# EasyEDA schematic PlanBElektronischSchema.json
TITLE: Sheet_1; REV: 1.0; Date: 2022-10-18; Sheet: 1/1; Drawn By: milanvannieuwenhuyze; Company: Your Company
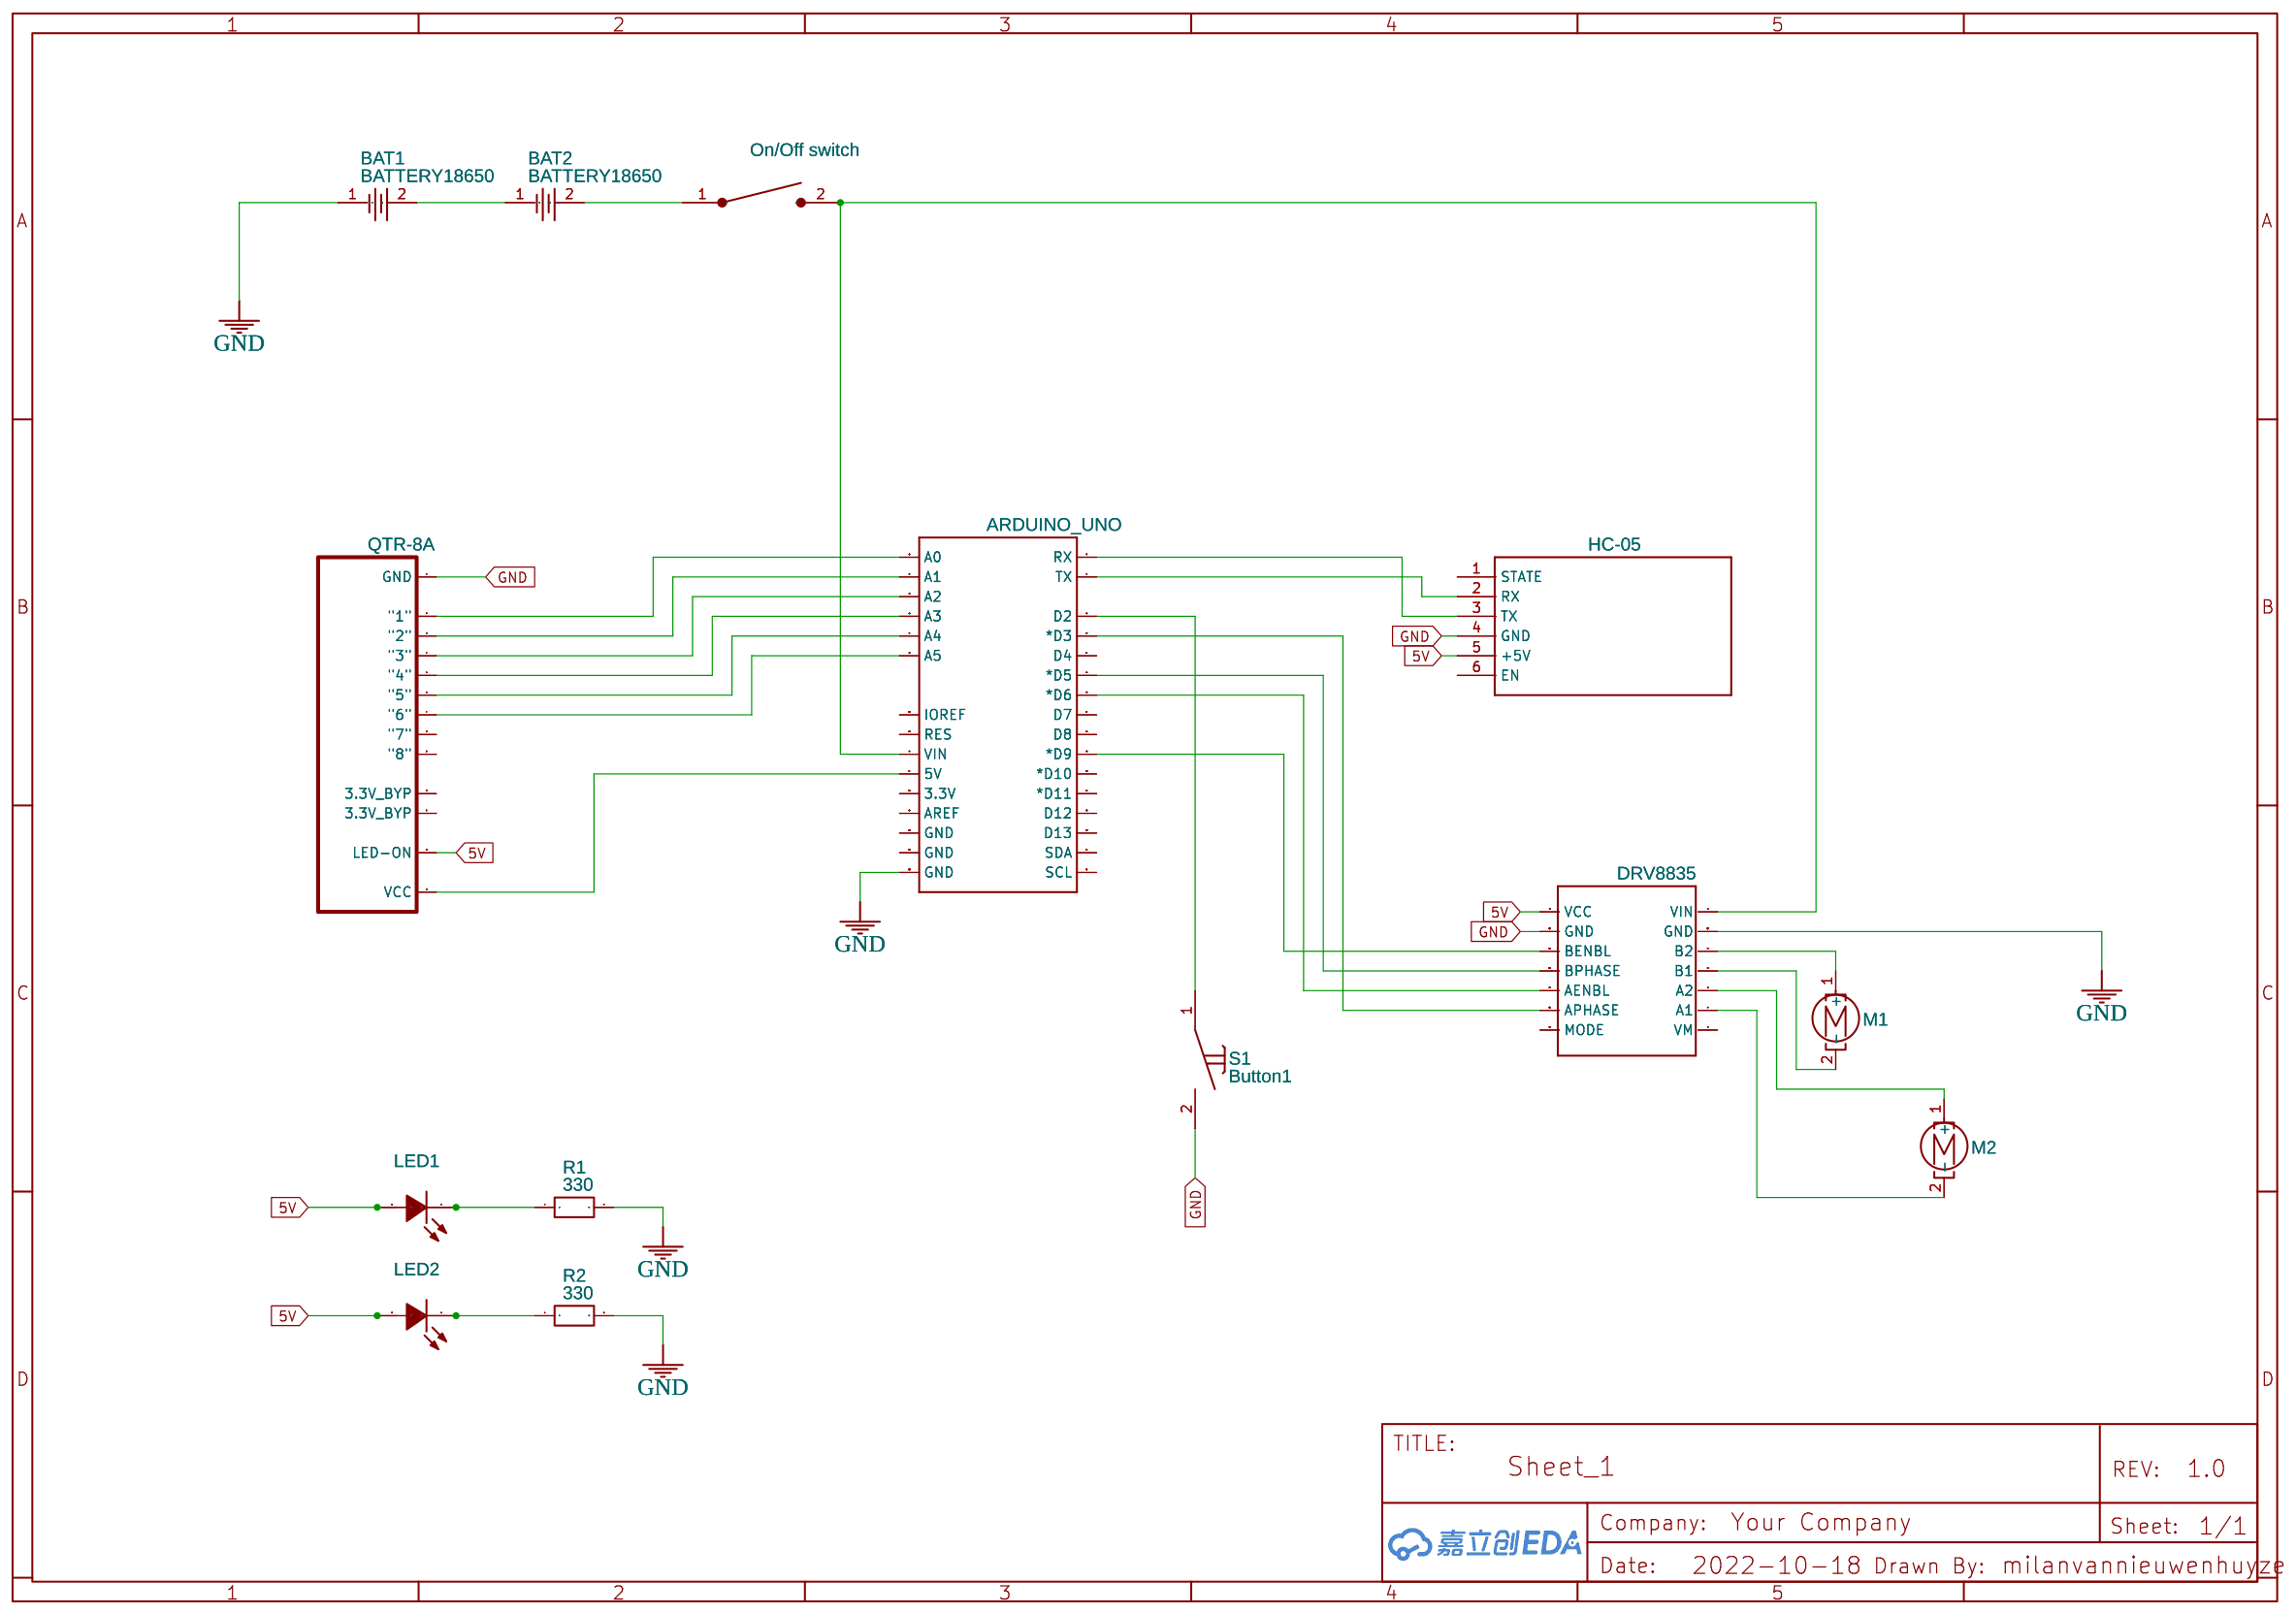
[diagram p0: schematic sheet]

## Parts
1  HC-05  [WIRELESS-BLUETOOTH-HC-05]
A2  DRV8835  [POLOLU_DRV8835]
BAT1  BATTERY18650  [BATTERY-SMD_18650-1S-L77.1-W20.7-1]
BAT2  BATTERY18650  [BATTERY-SMD_18650-1S-L77.1-W20.7-1]
LED1  BL-HUE35A-AV-TRE  [LED0805-RD_BRTLED_BL-HUE35A-AV-TRE]
LED2  BL-HUE35A-AV-TRE  [LED0805-RD_BRTLED_BL-HUE35A-AV-TRE]
M1  Motor_DC_ALT
M2  Motor_DC_ALT
R1  330  [R0603]
R2  330  [R0603]
S1  Button1  [3X5 PUSHBUTTON]
U1  ARDUINO_UNO  [UNO_R3_SHIELD_NOLABELS]
U2  QTR-8A  [QTR-8A/8RC]
U3  On/Off switch  [ON/OFF SWITCH]

## Library data of the parts
1 = WIRELESS-BLUETOOTH-HC-05: Contributor: Apdo Elnbrawy
A2 = POLOLU_DRV8835: Contributor: dcunderlik123
BAT1 BAT2 = BH-18650-B1BA002: Supplier: LCSC; Supplier Part: C2988620; Manufacturer: MYOUNG(美阳); link: https://atta.szlcsc.com/upload/public/pdf/source/20220402/870DB99AB50CA0DF8D51CF7C86A51FAB.pdf; Contributor: lcsc; JLCPCB Part Class: Extended Part
LED1 LED2 = BL-HUE35A-AV-TRE: Supplier: LCSC; Manufacturer: BrtLed; Contributor: LCSC; Supplier Part: C138549; JLCPCB Part Class: Extended Part
M1 M2 = Motor_DC_ALT: Contributor: KiCAD; license: https://www.gnu.org/licenses/lgpl-2.1.html
R1 R2 = R_0603_EU: Contributor: LCEDA_Lib
S1 = Button1: sourceId: K60iAuM3l
U1 = ARDUINO_R3_SHIELD: Contributor: SparkFun
U2 = QTR-8A: Manufacturer: Pololu; Supplier: Pololu; Supplier Part: 960; link: https://www.pololu.com/docs/pdf/0J12/QTR-8x.pdf; Contributor: Junikos
U3 = On/Off switch: Contributor: MarekFilip

## Nets
5V: 1.5(+5V) A2.VCC LED1.2(A) LED2.2(A) U1.5V U2.12(LED-ON)
GND: 1.4(GND) A2.GND@1(GND) A2.GND@2(GND) BAT1.1 R1.2 R2.2 S1.2 U1.GND@0(GND) U2.1(GND)
Net-(1-2): 1.2(RX) U1.TX
Net-(1-3): 1.3(TX) U1.RX
Net-(A2-A1): A2.A1 M2.2(-)
Net-(A2-A2): A2.A2 M2.1(+)
Net-(A2-AENBL): A2.AENBL U1.D6(*D6)
Net-(A2-APHASE): A2.APHASE U1.D3(*D3)
Net-(A2-B1): A2.B1 M1.2(-)
Net-(A2-B2): A2.B2 M1.1(+)
Net-(A2-BENBL): A2.BENBL U1.D9(*D9)
Net-(A2-BPHASE): A2.BPHASE U1.D5(*D5)
Net-(A2-VIN): A2.VIN U1.VIN U3.2
Net-(BAT1-2): BAT1.2 BAT2.1
Net-(BAT2-2): BAT2.2 U3.1
Net-(LED1-1): LED1.1(K) R1.1
Net-(LED2-1): LED2.1(K) R2.1
Net-(S1-1): S1.1 U1.D2
Net-(U1-A0): U1.A0 U2.2("1")
Net-(U1-A1): U1.A1 U2.3("2")
Net-(U1-A2): U1.A2 U2.4("3")
Net-(U1-A3): U1.A3 U2.5("4")
Net-(U1-A4): U1.A4 U2.6("5")
Net-(U1-A5): U1.A5 U2.7("6")

Not connected (* = marked no-connect by the designer): 1 1(STATE) 6(EN); A2 MODE VM; U1 3.3V AREF D4 D7 D8 D10(*D10) D11(*D11) D12 D13 GND@1(GND) GND@2(GND) IOREF RES SCL SDA; U2 8("7") 9("8") 10(3.3V BYP) 11(3.3V BYP)
